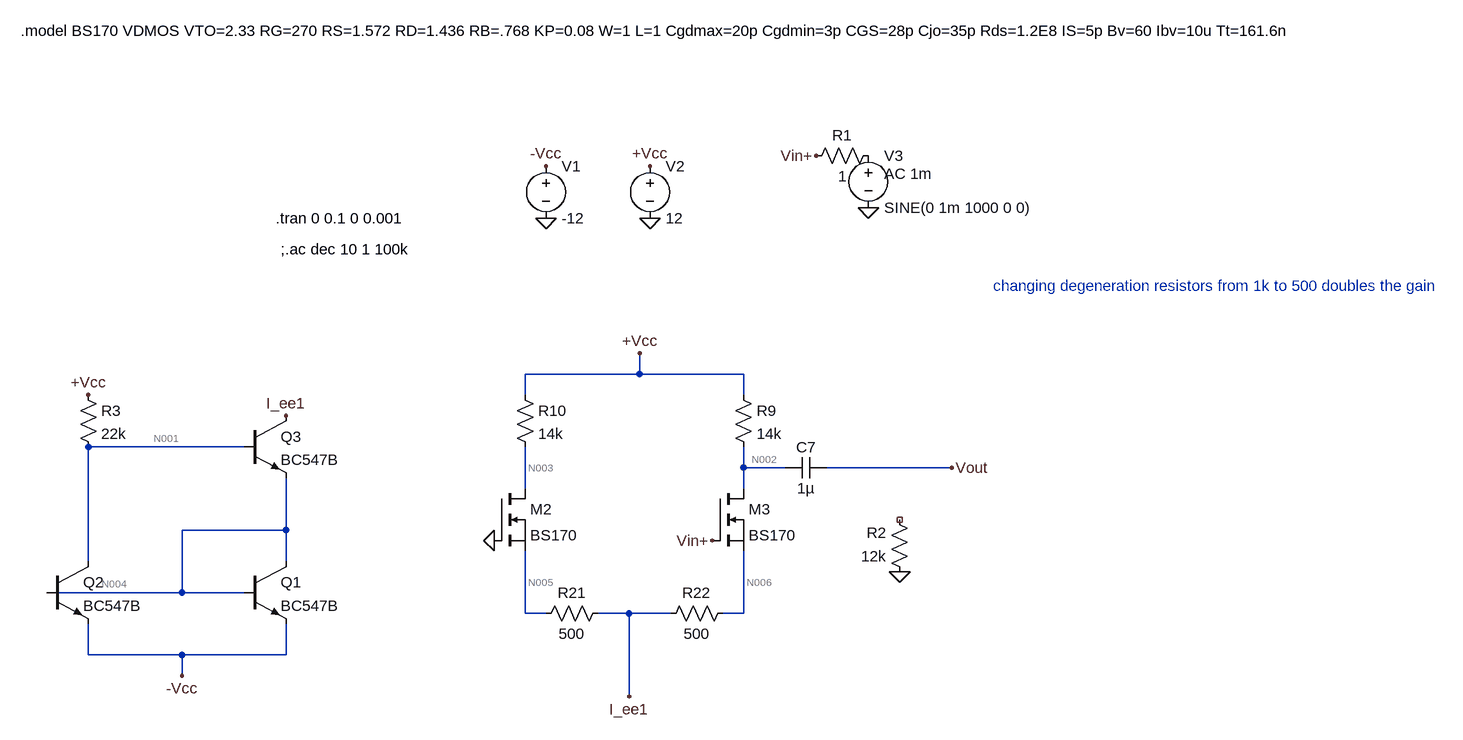
[diagram p0: schematic diff_amp.asc]
diff_amp.asc, the LTspice schematic file:
Version 4
SHEET 1 1780 1344
WIRE -768 0 -768 -32
WIRE -768 0 -944 0
WIRE -608 0 -768 0
WIRE -944 32 -944 0
WIRE -608 32 -608 0
WIRE -1376 112 -1616 112
WIRE -608 144 -608 112
WIRE -544 144 -608 144
WIRE -288 144 -480 144
WIRE -944 176 -944 112
WIRE -608 176 -608 144
WIRE -1312 240 -1312 160
WIRE -1312 240 -1472 240
WIRE -1616 288 -1616 112
WIRE -1312 288 -1312 240
WIRE -1472 336 -1472 240
WIRE -1472 336 -1680 336
WIRE -1376 336 -1472 336
WIRE -944 368 -944 272
WIRE -912 368 -944 368
WIRE -784 368 -832 368
WIRE -720 368 -784 368
WIRE -608 368 -608 272
WIRE -608 368 -640 368
WIRE -1616 432 -1616 384
WIRE -1472 432 -1616 432
WIRE -1312 432 -1312 384
WIRE -1312 432 -1472 432
WIRE -1472 464 -1472 432
WIRE -784 496 -784 368
FLAG -912 -240 0
FLAG -752 -240 0
FLAG -912 -320 -Vcc
FLAG -752 -320 +Vcc
FLAG -416 -256 0
FLAG -496 -336 Vin+
FLAG -768 -32 +Vcc
FLAG -288 144 Vout
FLAG -368 304 0
FLAG -1472 464 -Vcc
FLAG -1616 32 +Vcc
FLAG -1312 64 I_ee1
FLAG -784 496 I_ee1
FLAG -656 256 Vin+
FLAG -992 256 0
SYMBOL voltage -912 -336 R0
WINDOW 123 0 0 Left 0
WINDOW 39 0 0 Left 0
SYMATTR InstName V1
SYMATTR Value -12
SYMBOL voltage -752 -336 R0
WINDOW 123 0 0 Left 0
WINDOW 39 0 0 Left 0
SYMATTR InstName V2
SYMATTR Value 12
SYMBOL voltage -416 -352 R0
WINDOW 123 24 44 Left 2
WINDOW 39 0 0 Left 0
SYMATTR Value2 AC 1m
SYMATTR InstName V3
SYMATTR Value SINE(0 1m 1000 0 0)
SYMBOL res -400 -352 R90
WINDOW 0 0 56 VBottom 2
WINDOW 3 32 56 VTop 2
SYMATTR InstName R1
SYMATTR Value 1
SYMBOL nmos -992 176 R0
SYMATTR InstName M2
SYMATTR Value BS170
SYMBOL res -624 16 R0
SYMATTR InstName R9
SYMATTR Value 14k
SYMBOL res -960 16 R0
SYMATTR InstName R10
SYMATTR Value 14k
SYMBOL nmos -656 176 R0
SYMATTR InstName M3
SYMATTR Value BS170
SYMBOL res -816 352 R90
WINDOW 0 0 56 VBottom 2
WINDOW 3 32 56 VTop 2
SYMATTR InstName R21
SYMATTR Value 500
SYMBOL res -624 352 R90
WINDOW 0 0 56 VBottom 2
WINDOW 3 32 56 VTop 2
SYMATTR InstName R22
SYMATTR Value 500
SYMBOL cap -480 128 R90
WINDOW 0 0 32 VBottom 2
WINDOW 3 32 32 VTop 2
SYMATTR InstName C7
SYMATTR Value 1µ
SYMBOL res -352 320 R180
WINDOW 0 36 76 Left 2
WINDOW 3 36 40 Left 2
SYMATTR InstName R2
SYMATTR Value 12k
SYMBOL npn -1376 288 R0
SYMATTR InstName Q1
SYMATTR Value BC547B
SYMBOL npn -1680 288 R0
SYMATTR InstName Q2
SYMATTR Value BC547B
SYMBOL npn -1376 64 R0
SYMATTR InstName Q3
SYMATTR Value BC547B
SYMBOL res -1632 16 R0
SYMATTR InstName R3
SYMATTR Value 22k
TEXT -1328 -240 Left 2 !.tran 0 0.1 0 0.001
TEXT -1720 -528 Left 2 !.model BS170 VDMOS VTO=2.33 RG=270 RS=1.572 RD=1.436 RB=.768 KP=0.08 W=1 L=1 Cgdmax=20p Cgdmin=3p CGS=28p Cjo=35p Rds=1.2E8 IS=5p Bv=60 Ibv=10u Tt=161.6n
TEXT -1320 -192 Left 2 !;.ac dec 10 1 100k
TEXT -224 -136 Left 2 ;changing degeneration resistors from 1k to 500 doubles the gain

The netlist it stands for:
* diff_amp.asc
V1 -Vcc 0 -12
V2 +Vcc 0 12
V3 P001 0 SINE(0 1m 1000 0 0) AC 1m
R1 P001 Vin+ 1
M2 N003 0 N005 N005 BS170
R9 +Vcc N002 14k
R10 +Vcc N003 14k
M3 N002 Vin+ N006 N006 BS170
R21 I_ee1 N005 500
R22 N006 I_ee1 500
C7 Vout N002 1µ
R2 0 NC_01 12k
Q1 N004 N004 -Vcc 0 BC547B
Q2 N001 N004 -Vcc 0 BC547B
Q3 I_ee1 N001 N004 0 BC547B
R3 +Vcc N001 22k
.model NPN NPN
.model PNP PNP
.lib standard.bjt
.model NMOS NMOS
.model PMOS PMOS
.lib standard.mos
.tran 0 0.1 0 0.001
.model BS170 VDMOS VTO=2.33 RG=270 RS=1.572 RD=1.436 RB=.768 KP=0.08 W=1 L=1 Cgdmax=20p Cgdmin=3p CGS=28p Cjo=35p Rds=1.2E8 IS=5p Bv=60 Ibv=10u Tt=161.6n
;.ac dec 10 1 100k
* changing degeneration resistors from 1k to 500 doubles the gain
.backanno
.end

* Results of the author's LTspice run, read from the files saved beside the schematic
* Operating Point, zero values left out:
*   V(-vcc) = -12 V
*   V(+vcc) = 12 V
*   V(n003) = 4.836 V
*   V(n005) = -2.444 V
*   V(n002) = 4.836 V
*   V(n006) = -2.444 V
*   V(i_ee1) = -2.7 V
*   V(vout) = 4.836 µV
*   V(n004) = -11.36 V
*   V(n001) = -10.72 V
*   Ic(Q3) = 1.023 mA
*   Ib(Q3) = 3.206 µA
*   Ie(Q3) = -1.027 mA
*   Ic(Q2) = 1.03 mA
*   Ib(Q2) = 3.611 µA
*   Ie(Q2) = -1.033 mA
*   Ic(Q1) = 1.019 mA
*   Ib(Q1) = 3.611 µA
*   Ie(Q1) = -1.023 mA
*   Id(M3) = 511.7 µA
*   Is(M3) = -511.7 µA
*   Id(M2) = 511.7 µA
*   Is(M2) = -511.7 µA
*   I(R3) = 1.033 mA
*   I(R22) = 511.7 µA
*   I(R21) = -511.7 µA
*   I(R10) = 511.7 µA
*   I(R9) = 511.7 µA
*   I(V2) = -2.056 mA
*   I(V1) = 2.056 mA